# EAGLE design rele (EAGLE 4.01)
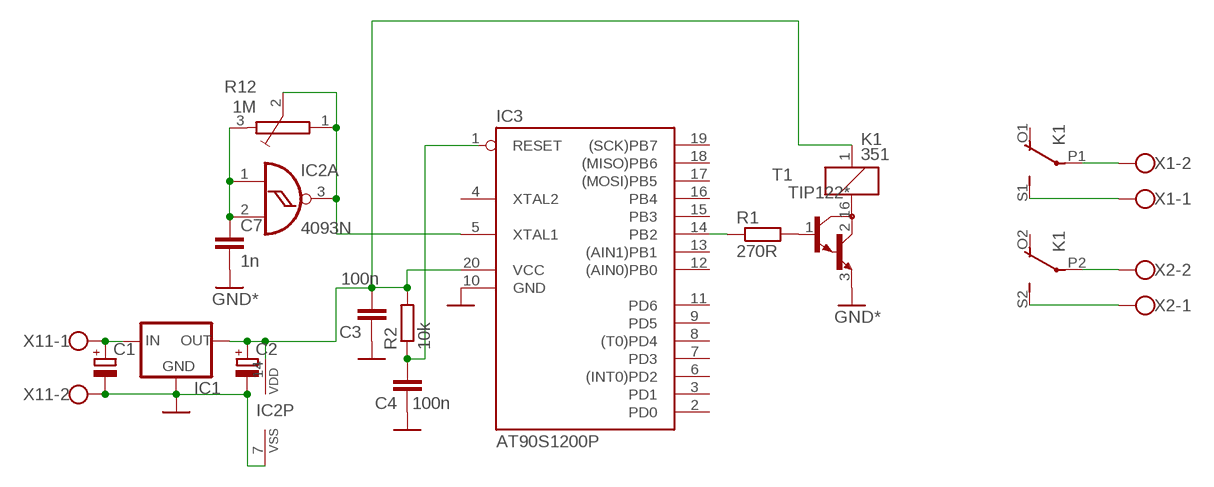
[diagram p0: schematic, sheet 1]

## Parts
C1  CPOL-EUE2.5-5  [E2,5-5]
C2  CPOL-EUE2.5-5  [E2,5-5]
C3  100n  C-EU050-025X075  [C050-025X075]
C4  100n  C-EU050-025X075  [C050-025X075]
C7  1n  C-EU050-025X075  [C050-025X075]
IC1  78LXX  [78LXX]
IC2  4093N  [DIL14]
IC3  AT90S1200P  [DIL20]
K1  351  [351]
R1  270R  R-EU_R0805  [R0805]
R2  10k  R-EU_R0805  [R0805]
R12  1M  LI10  [LI10]
T1  TIP122*  [TO220V]
X1  AK500/2  [AK500/2]
X2  AK500/2  [AK500/2]
X11  AK500/2  [AK500/2]

## Nets
GND: C1.- C2.- C3.2 C4.2 C7.1 IC1.GND IC2.7(P:VSS) IC3.10(GND) T1.3(E) X11.2 ; supply symbol labelled GND*
N$1: C2.+ C3.1 IC1.OUT IC2.14(P:VDD) IC3.20(VCC) K1.1 R2.2
N$2: C1.+ IC1.IN X11.1
N$4: R1.2 T1.1(B)
N$5: K1.S2(3:S) X2.1
N$6: K1.P2(3:P) X2.2
N$7: K1.S1(2:S) X1.1
N$8: K1.P1(2:P) X1.2
N$9: K1.16 T1.2(C)
N$40: C4.1 IC3.1(RESET) R2.1
N$41: C7.2 IC2.1(A:I0) IC2.2(A:I1) R12.3
N$42: IC2.3(A:O) IC3.5(XTAL1) R12.1 R12.2
N$47: IC3.14(PB2) R1.1
Unconnected: IC2.4(B:O) IC2.5(B:I0) IC2.6(B:I1) IC2.8(C:I0) IC2.9(C:I1) IC2.10(C:O) IC2.11(D:O) IC2.12(D:I0) IC2.13(D:I1) IC3.2(PD0) IC3.3(PD1) IC3.4(XTAL2) IC3.6((INT0)PD2) IC3.7(PD3) IC3.8((T0)PD4) IC3.9(PD5) IC3.11(PD6) IC3.12((AIN0)PB0) IC3.13((AIN1)PB1) IC3.15(PB3) IC3.16(PB4) IC3.17((MOSI)PB5) IC3.18((MISO)PB6) IC3.19((SCK)PB7) K1.O1(2:O) K1.O2(3:O)

## Library data of the parts
C1 C2 = rcl:CPOL-EU: POLARIZED CAPACITOR, European symbol
C3 C4 C7 = rcl:C-EU: CAPACITOR, European symbol
IC1 = v-reg:78LXX: VOLTAGE REGULATOR
IC2 = 40xx:4093: Quad 2-input NAND schmitt trigger
IC3 = atmel:AT90S1200: MICROCONTROLLER 1 Kbytes FLASH 64 bytes EEPROM
K1 = relay:351: RELAY 2 x switch, Omron
R1 R2 = rcl:R-EU_: RESISTOR, European symbol
R12 = pot:LI10: POTENTIOMETER
T1 = transistor-npn:TIP122: NPN BIPOLAR DARLINGTON TRANSISTOR
X1 X2 X11 = con-ptr500:AK500/2: CONNECTOR

## Board
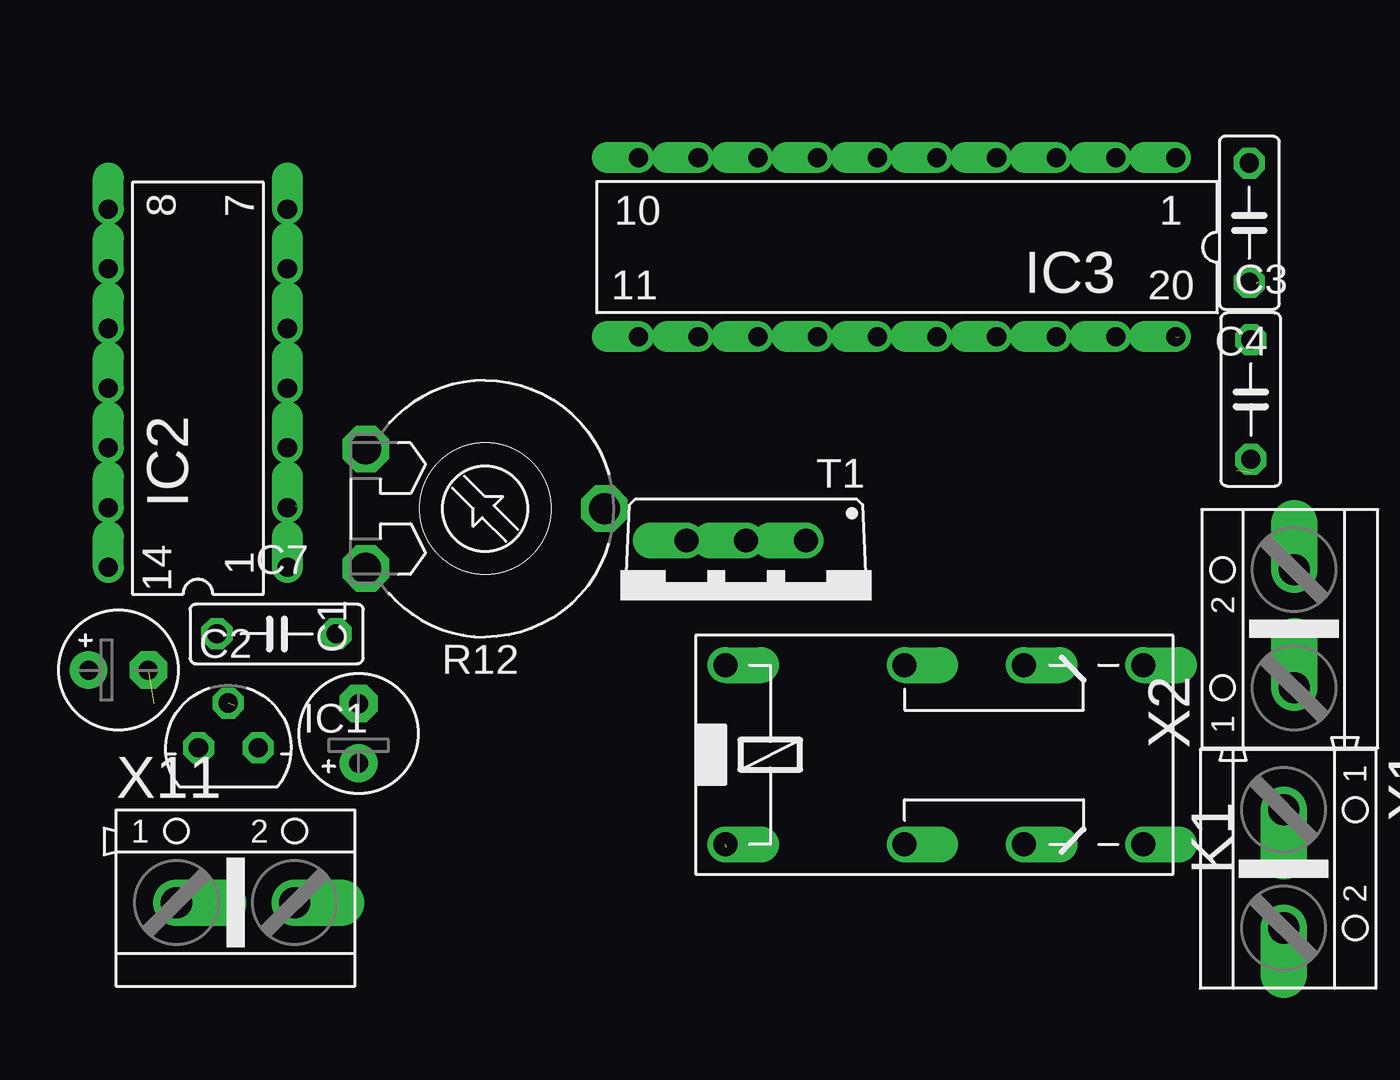
[diagram p1: board, top side]
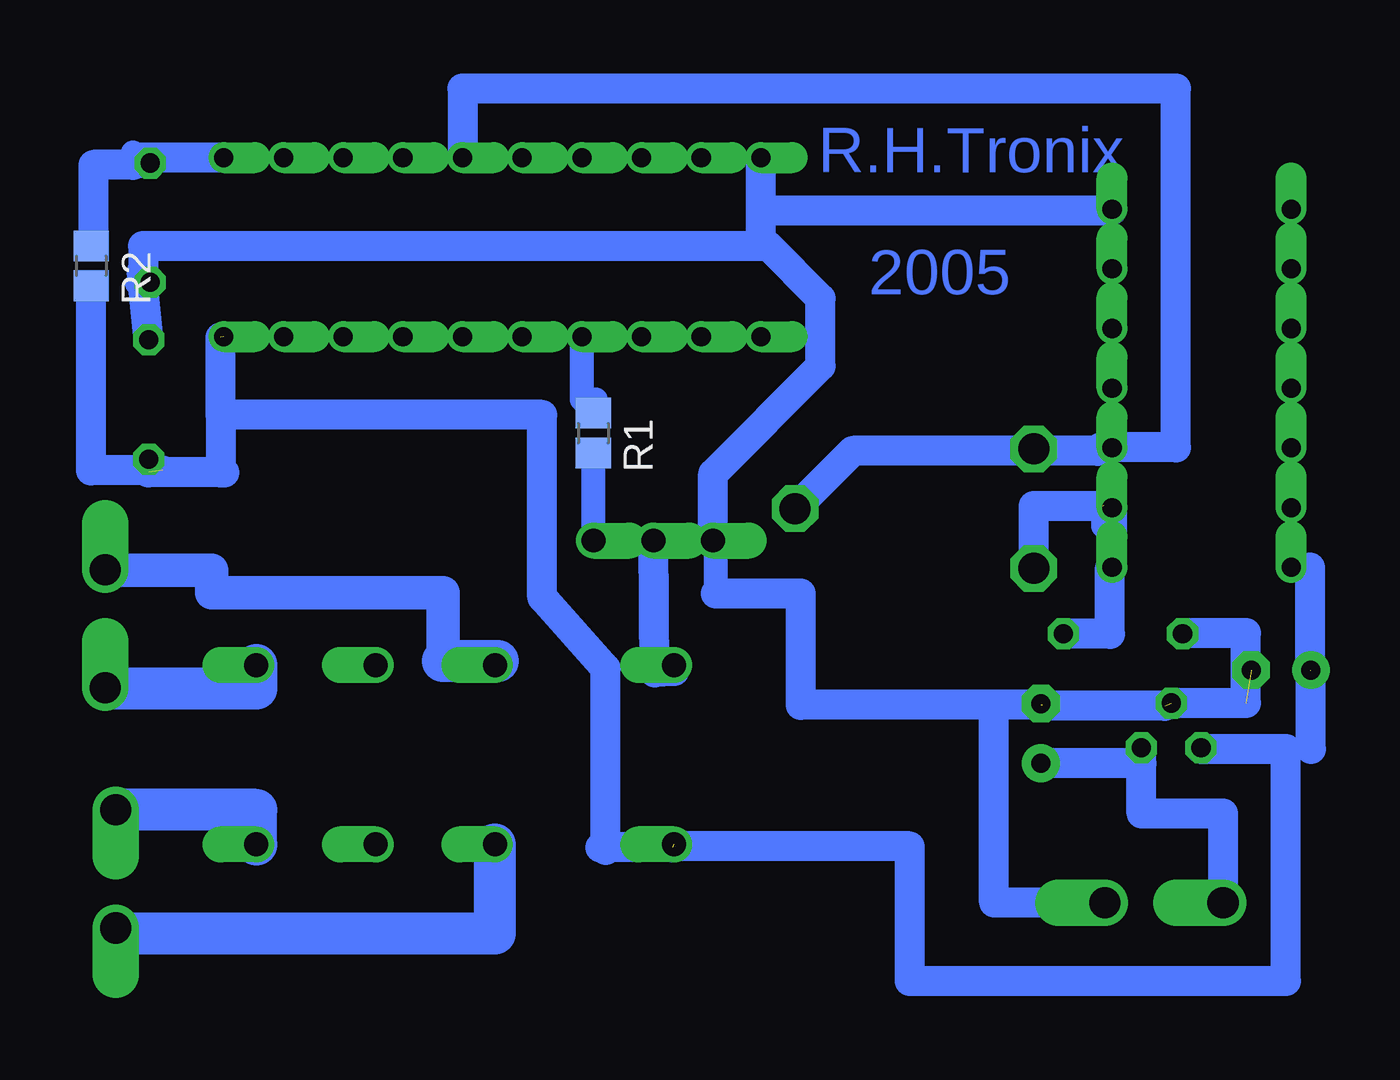
[diagram p2: board, bottom side, seen from below]

No outline drawn. Coordinates in mm, seen from the top.
Copper layers used: Bottom

### Footprints (pad centres in the part's own frame; a part is rotated, then mirrored left to right if it is on the bottom)
E2,5-5 = drill 0.813 pad 1.6 round: + -1.27,0 | drill 0.813 pad 1.6 octagon: - 1.27,0
C050-025X075 = drill 0.813 octagon: 1 -2.54,0; 2 2.54,0
78LXX = drill 0.813 octagon: GND 0,1.905; IN 1.27,0; OUT -1.27,0
DIL14 = drill 0.813 offset: 1 -7.62,-3.81; 2 -5.08,-3.81; 3 -2.54,-3.81; 4 0,-3.81; 5 2.54,-3.81; 6 5.08,-3.81; 7 7.62,-3.81; 8 7.62,3.81; 9 5.08,3.81; 10 2.54,3.81; 11 0,3.81; 12 -2.54,3.81; 13 -5.08,3.81; 14 -7.62,3.81
DIL20 = drill 0.813 offset: 1 -11.43,-3.81; 2 -8.89,-3.81; 3 -6.35,-3.81; 4 -3.81,-3.81; 5 -1.27,-3.81; 6 1.27,-3.81; 7 3.81,-3.81; 8 6.35,-3.81; 9 8.89,-3.81; 10 11.43,-3.81; 11 11.43,3.81; 12 8.89,3.81; 13 6.35,3.81; 14 3.81,3.81; 15 1.27,3.81; 16 -1.27,3.81; 17 -3.81,3.81; 18 -6.35,3.81; 19 -8.89,3.81; 20 -11.43,3.81
351 = drill 1.016 offset: 1 -3.81,-3.81; 16 -3.81,3.81; O1 8.89,-3.81; O2 8.89,3.81; P1 3.81,-3.81; P2 3.81,3.81; S1 13.97,-3.81; S2 13.97,3.81
R0805 = smd 1.3 x 1.5: 1 -0.85,0; 2 0.85,0
LI10 = drill 1.321 octagon: 1 -2.54,-5.08; 2 0,5.08; 3 2.54,-5.08
TO220V = drill 1.016 offset: 1 -2.54,-2.54; 2 0,-2.54; 3 2.54,-2.54
AK500/2 = drill 1.321 offset: 1 -2.515,0; 2 2.515,0

### Placement (x,y rotation side)
C1  55.45,38.93 90 top
C2  45.23,41.63 0 top
C3  93.42,53.14 90 top
C4  93.35,60.66 270 top
C7  51.96,43.17 0 top
IC1  49.9,38.32 0 top
IC2  48.61,53.62 90 top
IC3  78.79,59.62 180 top
K1  74.87,38.02 0 top
R1  74.49,51.71 270 bottom
R2  95.87,58.83 270 bottom
R12  60.83,48.5 270 top
T1  71.94,44.6 180 top
X1  94.82,33.17 270 top
X2  95.27,43.38 90 top
X11  50.21,31.73 0 top

### Tracks (layer width: path | path; a pad name or v marks a point on that pad's centre or on a via)
GND  (4 unrouted)
  Bottom 0.406: 49.46,43.2 49.42,43.2 C7.1 | C1.- 55.45,40.1 55.45,40.15 | 57.44,39.97 55.38,39.97 55.38,40.15 | 67.31,61.2 67.27,61.2 67.27,61.24 | 52.42,61.2 IC2.7
  Bottom 1.016: 93.71,58.12 93.71,58.02 | 93.71,58.12 C4.2 | 93.71,58.6 93.71,58.12 | 93.66,58.07 93.92,58.07 | 67.27,59.67 67.27,59.64 | 67.27,59.67 67.36,59.67 67.11,59.67 67.08,59.69 | 67.27,59.67 67.27,61.24 | T1.3 69.28,47.14 69.28,44.88
  Bottom 1.27: C3.2 93.71,58.6 | IC3.10 67.36,59.67 93.66,59.67 93.66,58.07 | 69.28,44.88 65.66,44.88 65.66,40.15 55.45,40.15 | T1.3 69.4,49.99 64.82,54.57 64.82,57.43 67.08,59.69 | IC1.GND 46.73,40.23 46.73,43.2 49.42,43.2 | 50.18,40.1 55.45,40.1 | X11.2 57.44,31.73 57.44,39.97 | 67.27,61.2 52.42,61.2
N$1  (4 unrouted)
  Bottom 0.406: 48.63,38.26 48.65,38.26 | 48.63,38.26 IC1.OUT | 48.63,38.26 43.96,38.26 | 43.99,46 IC2.14 | 70.94,34.21 K1.1
  Bottom 1.016: 74.19,34.09 73.97,33.98
  Bottom 1.27: 90.36,52.48 90.36,55.78 | 90.36,52.48 76.68,52.48 76.68,44.72 73.97,41.69 73.97,33.98 | 71.11,34.09 74.19,34.09 | 43.96,38.26 C2.+ | 43.99,41.63 43.99,46 | 48.63,38.26 45.02,38.26 45.02,28.39 61.03,28.39 61.03,34.13 70.94,34.13 70.94,34.21 70.94,34.23 | 90.36,50.04 90.19,50.04 | 90.36,52.48 90.36,50.04 | C3.1 93.42,50.04 90.36,50.04 | R2.2 95.87,50.13 92.83,50.13
N$2
  Bottom 0.406: IC1.IN 51.17,37.66 51.17,38.13 51.12,38.13
  Bottom 1.27: 51.17,37.66 C1.+ | X11.1 47.7,35.53 51.17,35.53 51.17,38.13
N$4
  Bottom 1.016: 74.48,47.18 T1.1 | 74.48,47.18 R1.2 | 74.48,47.18 74.54,47.18
N$5
  Bottom 1.016: 95.27,40.84 X2.1
  Bottom 1.778: K1.S2 88.84,40.84 95.27,40.84
N$6
  Bottom 1.016: K1.P2 78.55,41.83 78.55,42.01
  Bottom 1.422: 80.89,42.01 80.89,44.93 90.74,44.93 90.74,45.87 95.27,45.87 | 95.4,45.87 95.27,45.87 | 95.27,45.87 X2.2
  Bottom 1.778: 78.55,42.01 80.89,42.01
N$7
  Bottom 1.016: 94.93,35.68 X1.1
  Bottom 1.778: K1.S1 88.84,35.68 X1.1
N$8
  Bottom 1.016: 94.82,30.42 X1.2
  Bottom 1.778: K1.P1 78.68,30.42 94.82,30.42
N$9
  Bottom 1.016: K1.16 71.06,41.59
  Bottom 1.27: T1.2 71.89,41.53 71.06,41.59
N$40
  Bottom 1.016: 94.08,63.2 94.08,63.12 | 94.08,63.2 C4.1 93.76,63.2 | 94.08,63.2 94.08,63.64 | 93.76,63.2 93.76,63.07 | 93.76,63.43 93.76,63.2
  Bottom 1.27: IC3.1 93.76,63.43 | R2.1 95.78,59.68 95.78,63.12 94.08,63.12
N$41  (1 unrouted)
  Bottom 1.016: IC2.2 52.81,48.54 | IC2.1 52.51,46 52.51,46.09 | 52.81,48.54 52.81,48.59 | 52.81,48.54 52.81,47.77
  Bottom 1.27: IC2.1 IC2.2 | C7.2 52.51,43.17 52.51,46 | R12.3 55.75,48.62 52.76,48.62
N$42
  Bottom 1.016: 52.91,51.08 52.91,51 | 52.91,51.08 IC2.3 | 52.91,51.1 52.91,51.08 | 55.84,50.95 R12.1 55.77,51.01 55.77,50.95 | 52.91,51.08 53.04,50.95
  Bottom 1.27: IC3.5 80.06,66.37 49.7,66.37 49.7,51.1 52.91,51.1 | R12.2 63.46,50.95 55.84,50.95 | 53.04,50.95 55.77,50.95
N$47
  Bottom 1.016: 74.45,53.14 74.39,53.14 | R1.1 74.45,53.14 | IC3.14 74.98,53.14 74.45,53.14

### Text on the board
Bottom: R.H.Tronix | 2005